# EAGLE design arduino_led_debug (EAGLE 9.4.1)
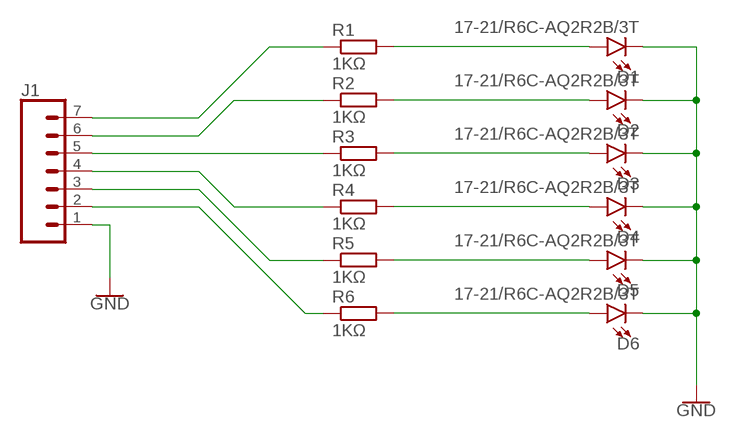
[diagram p0: schematic, sheet 1]

## Parts
D1  17-21/R6C-AQ2R2B/3T  1721R6CAQ2R2B3TX_C113551_1721R6CAQ2R2B3T_0805  [LED_0805]
D2  17-21/R6C-AQ2R2B/3T  1721R6CAQ2R2B3TX_C113551_1721R6CAQ2R2B3T_0805  [LED_0805]
D3  17-21/R6C-AQ2R2B/3T  1721R6CAQ2R2B3TX_C113551_1721R6CAQ2R2B3T_0805  [LED_0805]
D4  17-21/R6C-AQ2R2B/3T  1721R6CAQ2R2B3TX_C113551_1721R6CAQ2R2B3T_0805  [LED_0805]
D5  17-21/R6C-AQ2R2B/3T  1721R6CAQ2R2B3TX_C113551_1721R6CAQ2R2B3T_0805  [LED_0805]
D6  17-21/R6C-AQ2R2B/3T  1721R6CAQ2R2B3TX_C113551_1721R6CAQ2R2B3T_0805  [LED_0805]
J1  CONN_07LOCK  [1X07_LOCK]
R1  1KΩ  1K_1001_1%_C11702_1K_1001_1%_0402  [RESISTOR_0402]
R2  1KΩ  1K_1001_1%_C11702_1K_1001_1%_0402  [RESISTOR_0402]
R3  1KΩ  1K_1001_1%_C11702_1K_1001_1%_0402  [RESISTOR_0402]
R4  1KΩ  1K_1001_1%_C11702_1K_1001_1%_0402  [RESISTOR_0402]
R5  1KΩ  1K_1001_1%_C11702_1K_1001_1%_0402  [RESISTOR_0402]
R6  1KΩ  1K_1001_1%_C11702_1K_1001_1%_0402  [RESISTOR_0402]

## Nets
GND: D1.C D2.C D3.C D4.C D5.C D6.C J1.1
N$1: D1.A R1.1
N$2: D2.A R2.1
N$3: D3.A R3.1
N$4: J1.7 R1.2
N$5: D4.A R4.1
N$6: J1.2 R6.2
N$7: J1.3 R5.2
N$8: J1.4 R4.2
N$9: J1.5 R3.2
N$10: J1.6 R2.2
N$11: D5.A R5.1
N$12: D6.A R6.1

## Library data of the parts
D1-D6 = Optocouplers & LEDs & Infrared.expanded:1721R6CAQ2R2B3T; JLCPCB_IS_BASIC: no; LCSC_PART: C113551
J1 = SparkFun-Connectors:CONN_07: Multi connection point. Often used as Generic Header-pin footprint for 0.1 inch spaced/style header connections On any of the 0.1 inch spaced packages, you can populate with these: Break Away Headers - Straight <https://www.sparkfun.com/products/116> (PRT-00116) Break Away Male Headers - Right Angle <https://www.sparkfun.com/products/553> (PRT-00553) Female Headers <https://www.sparkfun.com/products/115> (PRT-00115) Break Away Headers - Machine Pin <https://www.sparkfun.com/products/117> (PRT-00117) Break Away Female Headers - Swiss Machine Pin <https://www.sparkfun.com/products/743> (PRT-00743) For SCREWTERMINALS and SPRING TERMINALS visit here: Screw Terimnals on SparkFun.com <https://www.sparkfun.com/search/results?term=Screw+Terminals> (5mm/3.5mm/2.54mm spacing) This device is also useful as a general connection point to wire up your design to another part of your project. Our various solder wires solder well into these plated through hole pads. Hook-Up Wire - Assortment (Stranded, 22 AWG) <https://www.sparkfun.com/products/11375> (PRT-11375) Hook-Up Wire - Assortment (Solid Core, 22 AWG) <https://www.sparkfun.com/products/11367> (PRT-11367) View the entire wire category on our website here <https://www.sparkfun.com/categories/141> Special notes: Molex polarized connector foot print use with SKU : PRT-08231 with associated crimp pins and housings. 1MM SMD Version SKU: PRT-10208 NOTES ON THE VARIANTS LOCK and LOCK_LONGPADS... This footprint was designed to help hold the alignment of a through-hole component (i.e. 6-pin header) while soldering it into place. You may notice that each hole has been shifted either up or down by 0.005 of an inch from it's more standard position (which is a perfectly straight line). This slight alteration caused the pins (the squares in the middle) to touch the edges of the holes. Because they are alternating, it causes a "brace" to hold the component in place. 0.005 has proven to be the perfect amount of "off-center" position when using our standard breakaway headers. Although looks a little odd when you look at the bare footprint, once you have a header in there, the alteration is very hard to notice. Also,if you push a header all the way into place, it is covered up entirely on the bottom side.
R1-R6 = Resistors.basic:1K_1001_1%; JLCPCB_IS_BASIC: yes; LCSC_PART: C11702

## Board
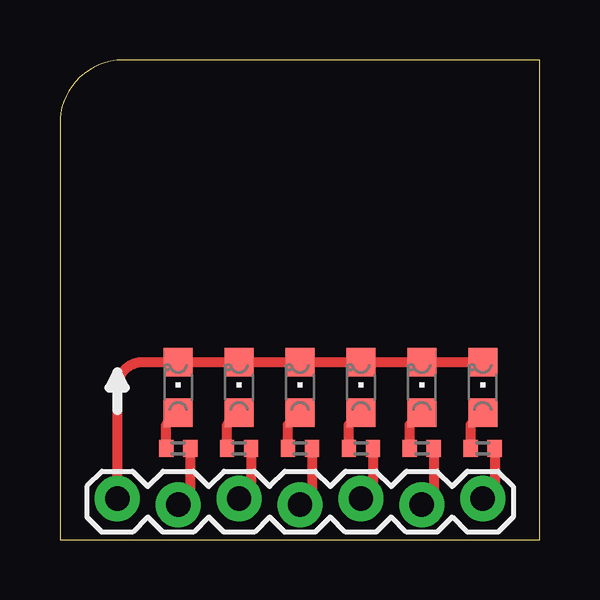
[diagram p1: board, top side]

Size 20 x 20.01 mm. Coordinates in mm from the lower left corner, seen from the top.
Outline: 0,0 20,0 20,20 2.84,20 arc90 0,17.55 0,0
Copper layers (1*16): Top 0.035mm / dielectric 1.6mm / Bottom 0.035mm
Design rules "jlcpcb-2layers": minimum track width 5mil, minimum drill 0.3mm, track to track 5mil, track to pad 5mil, pad to pad 5mil, via to via 5mil, smd to smd 5mil, copper to edge 0.2mm, drill to drill 6mil, minimum pad ring 10mil, minimum via ring 3mil, stop-mask expansion 4mil, vias tented up to drill 0mil, thermal gap 10mil

### Footprints (pad centres in the part's own frame; a part is rotated, then mirrored left to right if it is on the bottom)
LED_0805 = smd 1.2 x 1.2: A 0,-1.05; C 0,1.05
1X07_LOCK = drill 1.016 pad 1.88: 1 0,0.127; 2 2.54,-0.127; 3 5.08,0.127; 4 7.62,-0.127; 5 10.16,0.127; 6 12.7,-0.127; 7 15.24,0.127
RESISTOR_0402 = smd 0.6 x 0.7: 1 -0.5,0; 2 0.5,0

### Placement (x,y rotation side)
D1  17.63,6.35 0 top
D2  15.09,6.35 0 top
D3  12.55,6.35 0 top
D4  10.01,6.35 0 top
D5  7.47,6.35 0 top
D6  4.93,6.35 0 top
J1  2.39,1.59 0 top
R1  17.63,3.81 0 top
R2  15.09,3.81 0 top
R3  12.55,3.81 0 top
R4  10.01,3.81 0 top
R5  7.47,3.81 0 top
R6  4.93,3.81 0 top

### Tracks (layer width: path | path; a pad name or v marks a point on that pad's centre or on a via)
GND
  Top 0.406: D1.C D2.C D3.C D4.C D5.C D6.C 3.44,7.4 arc90 2.39,6.35 J1.1
N$1
  Top 0.406: R1.1 17.13,4.8 D1.A
N$2
  Top 0.406: R2.1 14.59,4.8 D2.A
N$3
  Top 0.406: R3.1 12.05,4.8 D3.A
N$4
  Top 0.406: R1.2 18.13,2.21 J1.7
N$5
  Top 0.406: R4.1 9.51,4.8 D4.A
N$6
  Top 0.406: R6.2 5.43,1.96 J1.2
N$7
  Top 0.406: R5.2 7.97,2.21 J1.3
N$8
  Top 0.406: R4.2 10.51,1.96 J1.4
N$9
  Top 0.406: R3.2 13.05,2.21 J1.5
N$10
  Top 0.406: R2.2 15.59,1.96 J1.6
N$11
  Top 0.406: R5.1 6.97,4.8 D5.A
N$12
  Top 0.406: R6.1 4.43,4.8 D6.A